# Altium project PCB_Node.PrjPcb
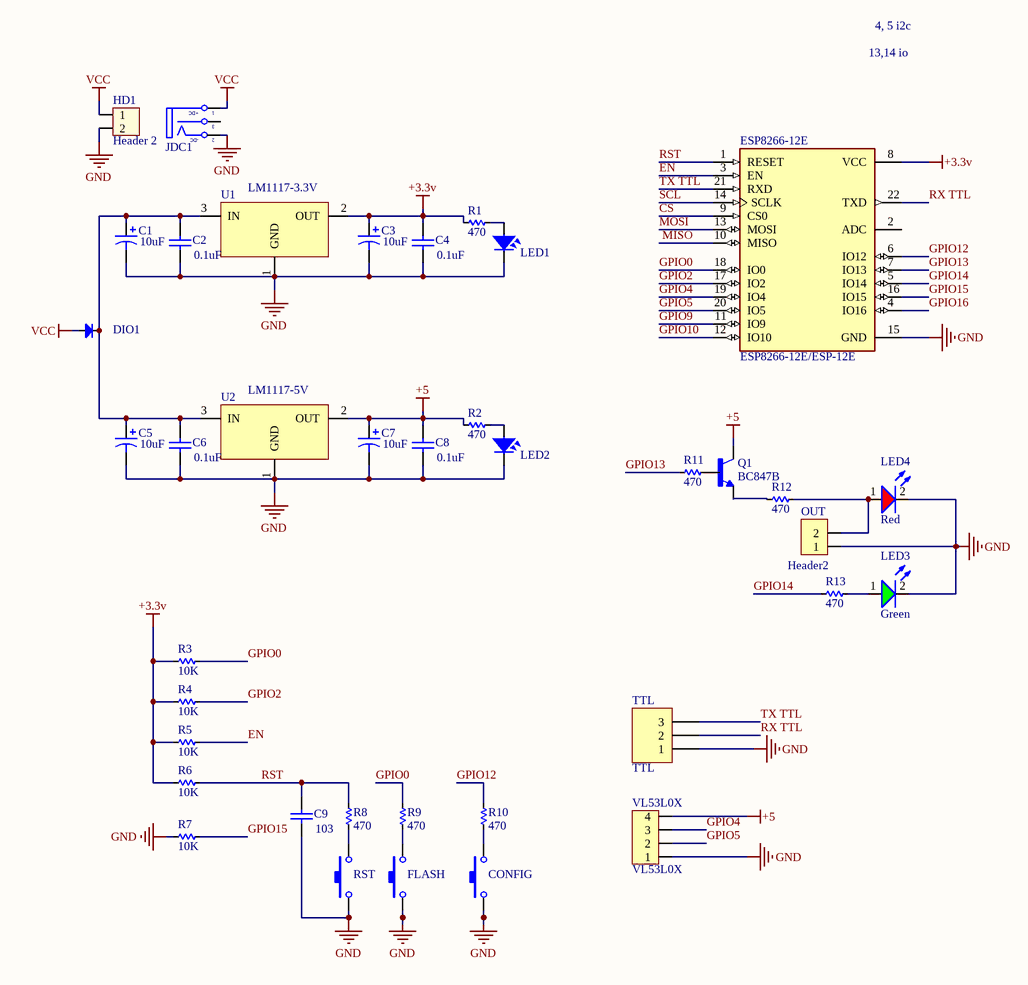
[diagram p0: Schematic_Node.SchDoc]
1 sheet, 39 parts. Net scope: global (net labels, ports and power ports of the same name join across sheets).
Board file: PCB_Node.PcbDoc

## Sheet Schematic_Node.SchDoc
size 381 x 241 mm; SheetNumber: 1; SheetTotal: 1

### Parts
C1  value 10uF  [C0805]  (hidden comment: Cap Pol3)
C2  value 0.1uF  [C1206]
C3  value 10uF  [C0805]  (hidden comment: Cap Pol3)
C4  value 0.1uF  [C1206]  (hidden comment: Cap Semi)
C5  value 10uF  [C0805]  (hidden comment: Cap Pol3)
C6  value 0.1uF  [C1206]
C7  value 10uF  [C0805]  (hidden comment: Cap Pol3)
C8  value 0.1uF  [C1206]  (hidden comment: Cap Semi)
C9  value 103  [C1206]  (hidden comment: Cap Semi)
CONFIG  SW-SMD  [SW-SMD]  (value not drawn)
DIO1  Diode SMD  [DIO-SMD-106]  (value not drawn)
ESP8266-12E  ESP8266-12E/ESP-12E  [XCVR_ESP8266-12E/ESP-12E]
FLASH  SW-SMD  [SW-SMD]  (value not drawn)
HD1  Header 2  [HED2]
JDC1  Jack DC  [DC-IN]  (value not drawn)
LED1  LED  [LED-1206-Red]  (value not drawn)
LED2  LED  [LED-1206-Red]  (value not drawn)
LED3  value Green  [LED-GREEN-0805]  (hidden comment: LED-Green)
LED4  value Red  [LED-RED-0805]  (hidden comment: LED-Red)
OUT  Header2  [HDR2]
Q1  BC847B  [SOT100P230X110-3N]
R1  470  [RES-SMD-1206]
R2  470  [RES-SMD-1206]
R3  10K  [RES-SMD-1206]
R4  10K  [RES-SMD-1206]
R5  10K  [RES-SMD-1206]
R6  10K  [RES-SMD-1206]
R7  10K  [RES-SMD-1206]
R8  470  [RES-SMD-1206]
R9  470  [RES-SMD-1206]
R10  470  [RES-SMD-1206]
R11  470  [RES-SMD-1206]
R12  470  [RES-SMD-1206]
R13  470  [RES-SMD-1206]
RST  SW-SMD  [SW-SMD]  (value not drawn)
TTL  TTL  [HDR1X3]
U1  LM1117-3.3V  [SOT223]
U2  LM1117-5V  [SOT223]
VL53L0X  VL53L0X  [HDR4]

### Nets
+3.3v: C3.1 C4.2 ESP8266-12E.8(VCC) R1.2 R3.2 R4.2 R5.2 R6.2 U1.2(OUT)
+5: C7.1 C8.2 Q1.3(C) R2.2 U2.2(OUT) VL53L0X.4
GND: C1.2 C2.1 C3.2 C4.1 C5.2 C6.1 C7.2 C8.1 C9.1 CONFIG.1 ESP8266-12E.15(GND) FLASH.1 HD1.2 JDC1.2(TN) LED1.2 LED2.2 LED3.2(K) LED4.2(K) OUT.1 R7.2 RST.1 TTL.1 U1.1(GND) U2.1(GND) VL53L0X.1
VCC: DIO1.1(A) HD1.1 JDC1.1(T)
CS: ESP8266-12E.9(CS0)
EN: ESP8266-12E.3(EN) R5.1
GPIO0: ESP8266-12E.18(IO0) R3.1 R9.1
GPIO2: ESP8266-12E.17(IO2) R4.1
GPIO4: ESP8266-12E.19(IO4) VL53L0X.3
GPIO5: ESP8266-12E.20(IO5) VL53L0X.2
GPIO9: ESP8266-12E.11(IO9)
GPIO10: ESP8266-12E.12(IO10)
GPIO12: ESP8266-12E.6(IO12) R10.1
GPIO13: ESP8266-12E.7(IO13) R11.2
GPIO14: ESP8266-12E.5(IO14) R13.2
GPIO15: ESP8266-12E.16(IO15) R7.1
GPIO16: ESP8266-12E.4(IO16)
MOSI: ESP8266-12E.13(MOSI)
RST: C9.2 ESP8266-12E.1(RESET) R6.1 R8.1
RX TTL: ESP8266-12E.22(TXD) TTL.2
SCL: ESP8266-12E.14(SCLK)
TX TTL: ESP8266-12E.21(RXD) TTL.3
MISO: ESP8266-12E.10(MISO)
NetC1_1: C1.1 C2.2 C5.1 C6.2 DIO1.2(K) U1.3(IN) U2.3(IN)
NetCONFIG_2: CONFIG.2 R10.2
NetFLASH_2: FLASH.2 R9.2
NetLED1_1: LED1.1 R1.1
NetLED2_1: LED2.1 R2.1
NetLED3_1: LED3.1(A) R13.1
NetLED4_1: LED4.1(A) OUT.2 R12.1
NetQ1_1: Q1.1(B) R11.1
NetQ1_2: Q1.2(E) R12.2
NetR8_2: R8.2 RST.2

Not connected (* = marked no-connect by the designer): ESP8266-12E 2(ADC); JDC1 3(S)

### Notes on the sheet
- 13,14 io
- 4, 5 i2c
- (in symbol Jack DC) +DC; -DC

### Library data of the parts
C1 C3 C5 C7 = Cap Pol3: Polarized Capacitor (Surface Mount); Published: 8-Jun-2000; LatestRevisionDate: 29-May-2009; LatestRevisionNote: IPC-7351 Footprint Added.; PackageReference: C0805; Publisher: Altium Limited; PackageDescription: Chip Capacitor
C2 C4 C6 C8 C9 = Cap Semi: Capacitor (Semiconductor SIM Model); Published: 8-Jun-2000; LatestRevisionDate: 29-May-2009; LatestRevisionNote: IPC-7351 Footprint Added.; PackageReference: C1206; Publisher: Altium Limited; PackageDescription: Chip Capacitor
CONFIG FLASH RST = SW-SMD: Switch; Published: 24-Mar-1999; LatestRevisionDate: 17-Jul-2002; LatestRevisionNote: Re-released for DXP Platform.; PackageReference: SPST-2; Publisher: Altium Limited
DIO1 = Diode SMD: Default Diode; Code - JEDEC: DO-214-AB; Value: 1N5007; Published: 8-Jun-2000; Revision: July-2002: Re-released for DXP Platform.; Publisher: Altium Limited
ESP8266-12E = ESP8266-12E/ESP-12E: This WiFi module has a 32-bit MCU micro and clock speeds supporting 80 MHz or 160 MHz. Supports the RTOS and integrated Wi-Fi MAC/BB/RF/PA/LNA, and has an on-board antenna.; MF: AI-Thinker; Price: None; Package: None; Value: *; MP: ESP8266-12E/ESP-12E; Availability: Unavailable; SnapEDA_Link: https://www.snapeda.com/parts/ESP8266-12E/ESP-12E/AI-Thinker/view-part/106414/?ref=snap
HD1 = Hed2: Header 2 (Green); Value: Header 2
JDC1 = Jack DC: Jack DC input; Value: Jac DC
LED1 LED2 = LED SMD: Value: LED 3 - 5 ly 2 Colour
LED3 = LED-Green: LED Green 2mA 3V 0805; ComponentLink1Description: Datasheet; ComponentLink1URL: D:\Dropbox\Datasheets\Opto and Illumination\LEDs\SMD LED.pdf; Unit Price: 0.0476
LED4 = Led-Red: LED Red 2mA 1.8V 0805; ComponentLink1Description: Datasheet; ComponentLink1URL: D:\Dropbox\Datasheets\Opto and Illumination\LEDs\SMD LED.pdf; Unit Price: 0.0476
OUT = Header2: Header IDC, 2 x 1 Pin Vertical 2.54mm Pitch (Non-Boxed, Male); Manufacturer: W¨¹rth Elektronik eiSos GmbH; partNo: 613002143121; ComponentLink1 Description: Manufacturer; ComponentLink2 Description: Datasheet; NoPins: 02; Created Date: 29 March 2013; ComponentLink1URL: http://www.we-online.com; ComponentLink2URL: http://katalog.we-online.de/em/datasheet/6130xx143121.pdf; Created by: Karrer Zheng
Q1 = BC847B: Bipolar (BJT) Transistor NPN 45V 100mA 100MHz 150mW Surface Mount SOT-523; MF: STMicroelectronics; Availability: Unavailable; Package: SOT-23-3 NXP Semiconductors; Price: None; SnapEDA_Link: https://www.snapeda.com/parts/BC847B/STMicroelectronics/view-part/945669/?ref=snap; Value: *; MP: BC847B
R1-R13 = Res-SMD: Resistor; Manufacturer: Generic Components; Class: Passive; Published: 08/06/2000; Publisher: Altium Hobart Technology Centre
TTL = Header 3: Header, 3-Pin; LatestRevisionDate: 17-Jul-2002; LatestRevisionNote: Re-released for DXP Platform.; Publisher: Altium Limited
U1 U2 = LM1117: 800mA Low-Dropout Linear Regulator; Creator: Nguyen Ba Bien; Website: http://group3i.net
VL53L0X = Header4: Header IDC, 4 x 1 Pin Vertical 2.54mm Pitch (Non-Boxed, Male); Manufacturer: W¨¹rth Elektronik eiSos GmbH; partNo: 613002143121; ComponentLink1 Description: Manufacturer; ComponentLink2 Description: Datasheet; NoPins: 02; Created Date: 29 March 2013; ComponentLink1URL: http://www.we-online.com; ComponentLink2URL: http://katalog.we-online.de/em/datasheet/6130xx143121.pdf; Created by: Karrer Zheng